# Altium schematic sheet Controller.SchDoc
size Letter
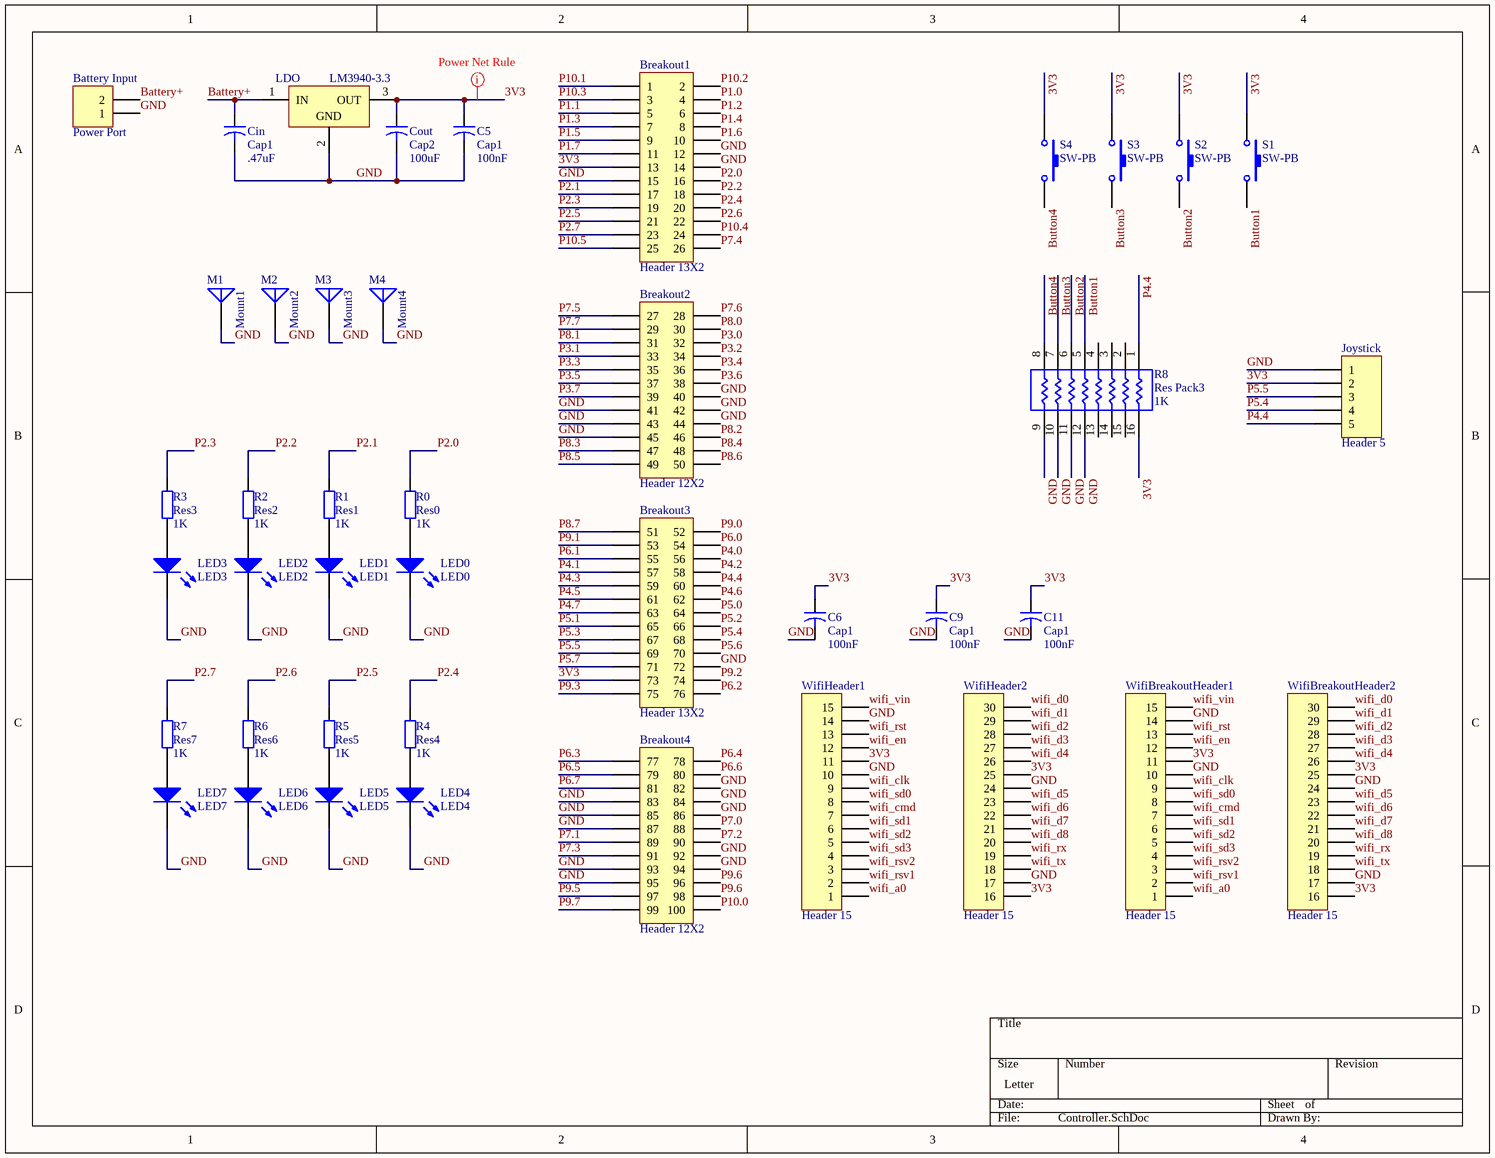
[diagram p0: Controller.SchDoc]

## Parts
Battery_Input  Power Port  [CON2screw]
Breakout1  Header 13X2  [HDR2X13]
Breakout2  Header 12X2  [HDR2X12]
Breakout3  Header 13X2  [HDR2X13]
Breakout4  Header 12X2  [HDR2X12]
C5  Cap1  value 100nF  [CAPR5-4X5]
C6  Cap1  value 100nF  [CAPR5-4X5]
C9  Cap1  value 100nF  [CAPR5-4X5]
C11  Cap1  value 100nF  [CAPR5-4X5]
Cin  Cap1  value .47uF  [CAPR5-4X5]
Cout  Cap2  value 100uF  [CAPR5-4X5]
Joystick  Header 5  [HDR1X5]
LDO  LM3940-3.3  [T03B]
LED0  LED0  [PIN2]
LED1  LED1  [PIN2]
LED2  LED2  [PIN2]
LED3  LED3  [PIN2]
LED4  LED4  [PIN2]
LED5  LED5  [PIN2]
LED6  LED6  [PIN2]
LED7  LED7  [PIN2]
M1  Mount1  [PIN1]
M2  Mount2  [PIN1]
M3  Mount3  [PIN1]
M4  Mount4  [PIN1]
R0  Res0  value 1K  [AXIAL-0.4]
R1  Res1  value 1K  [AXIAL-0.4]
R2  Res2  value 1K  [AXIAL-0.4]
R3  Res3  value 1K  [AXIAL-0.4]
R4  Res4  value 1K  [AXIAL-0.4]
R5  Res5  value 1K  [AXIAL-0.4]
R6  Res6  value 1K  [AXIAL-0.4]
R7  Res7  value 1K  [AXIAL-0.4]
R8  Res Pack3  value 1K  [DIP-16]
S1  SW-PB  [SW PB]
S2  SW-PB  [SW PB]
S3  SW-PB  [SW PB]
S4  SW-PB  [SW PB]
WifiBreakoutHeader1  Header 15  [HDR1X15]
WifiBreakoutHeader2  Header 15  [HDR1X15]
WifiHeader1  Header 15  [HDR1X15]
WifiHeader2  Header 15  [HDR1X15]

## Nets
3V3: Breakout1.13 Breakout3.23(73) C5.1 C6.1 C9.1 C11.1 Cout.1 Joystick.2 LDO.3(OUT) R8.16 S1.1 S2.1 S3.1 S4.1 WifiBreakoutHeader1.11 WifiBreakoutHeader2.1(16) WifiBreakoutHeader2.10(25) WifiHeader1.11 WifiHeader2.1(16) WifiHeader2.10(25)
Battery+: Battery_Input.2 Cin.1 LDO.1(IN)
Button1: R8.5 S1.2
Button2: R8.6 S2.2
Button3: R8.7 S3.2
Button4: R8.8 S4.2
GND: Battery_Input.1 Breakout1.12 Breakout1.14 Breakout1.15 Breakout2.14(40) Breakout2.15(41) Breakout2.16(42) Breakout2.17(43) Breakout2.18(44) Breakout2.19(45) Breakout3.22(72) Breakout4.6(82) Breakout4.7(83) Breakout4.8(84) Breakout4.9(85) Breakout4.10(86) Breakout4.11(87) Breakout4.16(92) Breakout4.17(93) Breakout4.18(94) Breakout4.19(95) C5.2 C6.2 C9.2 C11.2 Cin.2 Cout.2 Joystick.1 LDO.2(GND) LED0.2(K) LED1.2(K) LED2.2(K) LED3.2(K) LED4.2(K) LED5.2(K) LED6.2(K) LED7.2(K) M1.1(A) M2.1(A) M3.1(A) M4.1(A) R8.9 R8.10 R8.11 R8.12 WifiBreakoutHeader1.10 WifiBreakoutHeader1.14 WifiBreakoutHeader2.2(17) WifiBreakoutHeader2.9(24) WifiHeader1.10 WifiHeader1.14 WifiHeader2.2(17) WifiHeader2.9(24)
P1.0: Breakout1.4
P1.1: Breakout1.5
P1.2: Breakout1.6
P1.3: Breakout1.7
P1.4: Breakout1.8
P1.5: Breakout1.9
P1.6: Breakout1.10
P1.7: Breakout1.11
P2.0: Breakout1.16 R0.2
P2.1: Breakout1.17 R1.2
P2.2: Breakout1.18 R2.2
P2.3: Breakout1.19 R3.2
P2.4: Breakout1.20 R4.2
P2.5: Breakout1.21 R5.2
P2.6: Breakout1.22 R6.2
P2.7: Breakout1.23 R7.2
P3.0: Breakout2.6(32)
P3.1: Breakout2.7(33)
P3.2: Breakout2.8(34)
P3.3: Breakout2.9(35)
P3.4: Breakout2.10(36)
P3.5: Breakout2.11(37)
P3.6: Breakout2.12(38)
P3.7: Breakout2.13(39)
P4.0: Breakout3.6(56)
P4.1: Breakout3.7(57)
P4.2: Breakout3.8(58)
P4.3: Breakout3.9(59)
P4.4: Breakout3.10(60) Joystick.5 R8.1
P4.5: Breakout3.11(61)
P4.6: Breakout3.12(62)
P4.7: Breakout3.13(63)
P5.0: Breakout3.14(64)
P5.1: Breakout3.15(65)
P5.2: Breakout3.16(66)
P5.3: Breakout3.17(67)
P5.4: Breakout3.18(68) Joystick.4
P5.5: Breakout3.19(69) Joystick.3
P5.6: Breakout3.20(70)
P5.7: Breakout3.21(71)
P6.0: Breakout3.4(54)
P6.1: Breakout3.5(55)
P6.2: Breakout3.26(76)
P6.3: Breakout4.1(77)
P6.4: Breakout4.2(78)
P6.5: Breakout4.3(79)
P6.6: Breakout4.4(80)
P6.7: Breakout4.5(81)
P7.0: Breakout4.12(88)
P7.1: Breakout4.13(89)
P7.2: Breakout4.14(90)
P7.3: Breakout4.15(91)
P7.4: Breakout1.26
P7.5: Breakout2.1(27)
P7.6: Breakout2.2(28)
P7.7: Breakout2.3(29)
P8.0: Breakout2.4(30)
P8.1: Breakout2.5(31)
P8.2: Breakout2.20(46)
P8.3: Breakout2.21(47)
P8.4: Breakout2.22(48)
P8.5: Breakout2.23(49)
P8.6: Breakout2.24(50)
P8.7: Breakout3.1(51)
P9.0: Breakout3.2(52)
P9.1: Breakout3.3(53)
P9.2: Breakout3.24(74)
P9.3: Breakout3.25(75)
P9.5: Breakout4.21(97)
P9.6: Breakout4.20(96) Breakout4.22(98)
P9.7: Breakout4.23(99)
P10.0: Breakout4.24(100)
P10.1: Breakout1.1
P10.2: Breakout1.2
P10.3: Breakout1.3
P10.4: Breakout1.24
P10.5: Breakout1.25
wifi_a0: WifiBreakoutHeader1.1 WifiHeader1.1
wifi_clk: WifiBreakoutHeader1.9 WifiHeader1.9
wifi_cmd: WifiBreakoutHeader1.7 WifiHeader1.7
wifi_d0: WifiBreakoutHeader2.15(30) WifiHeader2.15(30)
wifi_d1: WifiBreakoutHeader2.14(29) WifiHeader2.14(29)
wifi_d2: WifiBreakoutHeader2.13(28) WifiHeader2.13(28)
wifi_d3: WifiBreakoutHeader2.12(27) WifiHeader2.12(27)
wifi_d4: WifiBreakoutHeader2.11(26) WifiHeader2.11(26)
wifi_d5: WifiBreakoutHeader2.8(23) WifiHeader2.8(23)
wifi_d6: WifiBreakoutHeader2.7(22) WifiHeader2.7(22)
wifi_d7: WifiBreakoutHeader2.6(21) WifiHeader2.6(21)
wifi_d8: WifiBreakoutHeader2.5(20) WifiHeader2.5(20)
wifi_en: WifiBreakoutHeader1.12 WifiHeader1.12
wifi_rst: WifiBreakoutHeader1.13 WifiHeader1.13
wifi_rsv1: WifiBreakoutHeader1.2 WifiHeader1.2
wifi_rsv2: WifiBreakoutHeader1.3 WifiHeader1.3
wifi_rx: WifiBreakoutHeader2.4(19) WifiHeader2.4(19)
wifi_sd0: WifiBreakoutHeader1.8 WifiHeader1.8
wifi_sd1: WifiBreakoutHeader1.6 WifiHeader1.6
wifi_sd2: WifiBreakoutHeader1.5 WifiHeader1.5
wifi_sd3: WifiBreakoutHeader1.4 WifiHeader1.4
wifi_tx: WifiBreakoutHeader2.3(18) WifiHeader2.3(18)
wifi_vin: WifiBreakoutHeader1.15 WifiHeader1.15
NetLED0_1: LED0.1(A) R0.1
NetLED1_1: LED1.1(A) R1.1
NetLED2_1: LED2.1(A) R2.1
NetLED3_1: LED3.1(A) R3.1
NetLED4_1: LED4.1(A) R4.1
NetLED5_1: LED5.1(A) R5.1
NetLED6_1: LED6.1(A) R6.1
NetLED7_1: LED7.1(A) R7.1

Not connected (* = marked no-connect by the designer): R8 2 3 4 13 14 15

## Layout directives
rule Width Constraint [Pref Width = 30mil    Min Width = 30mil    Max Width = 30mil]: 3V3

## Library data of the parts
Battery_Input = Power
Breakout1 Breakout3 = Header 13X2: Header, 13-Pin, Dual row; LatestRevisionDate: 17-Jul-2002; LatestRevisionNote: Re-released for DXP Platform.; Publisher: Altium Limited
Breakout2 Breakout4 = Header 12X2: Header, 12-Pin, Dual row; LatestRevisionDate: 17-Jul-2002; LatestRevisionNote: Re-released for DXP Platform.; Publisher: Altium Limited
C5 C6 C9 C11 Cin Cout = Cap2: Capacitor; Published: 23-Sep-2002; PackageReference: CAPR5-4X5; Publisher: Altium Limited; PackageDescription: Capacitor; 2 Leads
Joystick = Header 5: Header, 5-Pin; LatestRevisionDate: 17-Jul-2002; LatestRevisionNote: Re-released for DXP Platform.; Publisher: Altium Limited
LDO = LM2940CT-5.0: 1A Low Dropout Regulator, 3-pin TO-220; PartNumber: LM2940CT-3.3; Manufacturer: National Semiconductor; PackageTopMarking: NSUZXYTTE#*LM2940CT*-5.0 P+; PowerWise: N; CompType: LDO IC; High-Reliability: Y; DatasheetVersion: Jan-2007; PackageVersion: revL, Jan-1992; PackageReference: T03B; PackageDescription: TO-220, Molded, 3 Lead, Straight; RoHS: N; PinCount: 3; ComponentLink1Description: Manufacturer URL; ComponentLink1URL: http://www.national.com/; ComponentLink2Description: LM2940C Datasheet; ComponentLink2URL: http://www.national.com/ds/LM/LM2940C.pdf; ComponentLink3Description: LM2940C Web Page; ComponentLink3URL: http://www.national.com/pf/LM/LM2940C.html; ComponentLink4Description: T03B Package Page; ComponentLink4URL: http://www.national.com/packaging/folders/t03b.html
LED0-LED7 = LED0: Typical INFRARED GaAs LED; Published: 8-Jun-2000; LatestRevisionDate: 08-Jul-2005; LatestRevisionNote: Mech Layer 1 removed.; PackageReference: LED-0; Publisher: Altium Limited; PackageDescription: LED; 2 Leads
M1-M4 = Antenna: Generic Antenna; Published: 24-Mar-1999; LatestRevisionDate: 17-Jul-2002; LatestRevisionNote: Re-released for DXP Platform.; PackageReference: PIN1; Publisher: Altium Limited
R0-R7 = Res2: Resistor; Published: 8-Jun-2000; LatestRevisionDate: 17-Jul-2002; LatestRevisionNote: Re-released for DXP Platform.; PackageReference: AXIAL-0.4; Publisher: Altium Limited; PackageDescription: Axial Device, Thru-Hole; 2 Leads; 0.4 in Pin Spacing
R8 = Res Pack3: Isolated Resistor Network; Published: 24-Mar-1999; LatestRevisionDate: 29-May-2009; LatestRevisionNote: IPC-7351 Footprint Added.; PackageReference: SO-16; Publisher: Altium Limited; PackageDescription: 16-Pin Small Outline Integrated Circuit 1.27 mm Pitch; Code_JEDEC: MS-012-AC; Code_IPC: SOIC127P600-16
S1-S4 = SW-PB_2: DIGIKEY SW400-ND; Published: 24-Mar-1999; LatestRevisionDate: 17-Jul-2002; LatestRevisionNote: Re-released for DXP Platform.; Publisher: Altium Limited
WifiBreakoutHeader1 WifiBreakoutHeader2 WifiHeader1 WifiHeader2 = Header 15: Header, 15-Pin; LatestRevisionDate: 17-Jul-2002; LatestRevisionNote: Re-released for DXP Platform.; Publisher: Altium Limited